# EAGLE design stackclock_base (EAGLE 6.6.0)

## Sheet 1 of 2: Logic & I/O
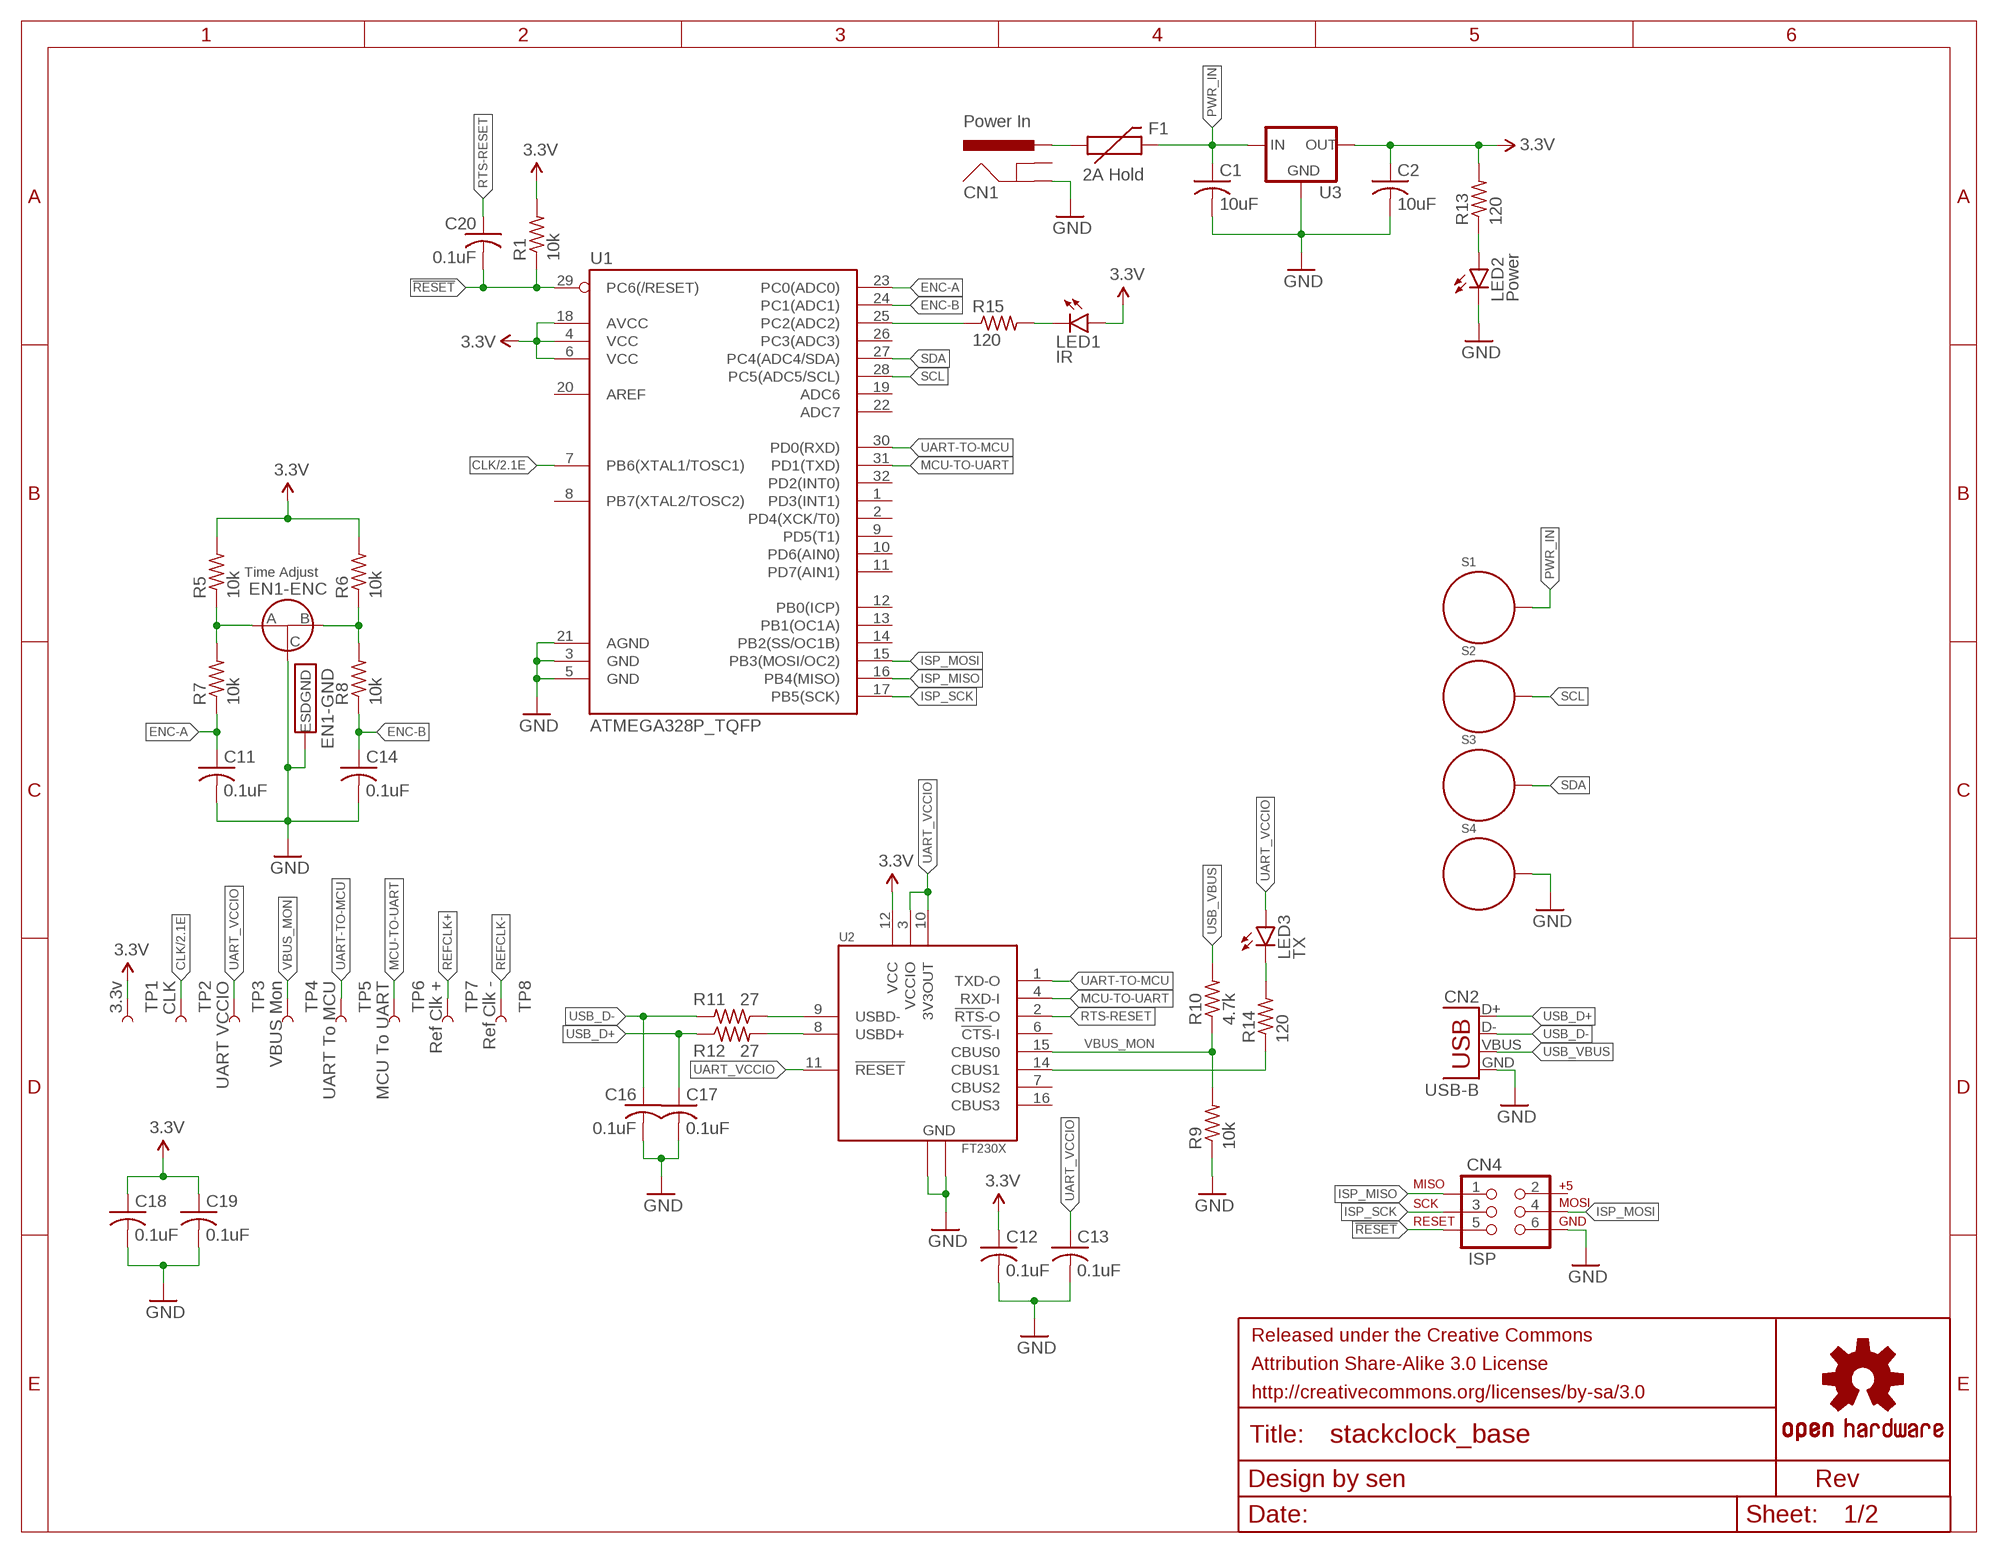
[diagram p0: schematic, sheet 1]

### Parts
C1  10uF  C-USC0805  [C0805]
C2  10uF  C-USC0805  [C0805]
C11  0.1uF  C-USC0603  [C0603]
C12  0.1uF  C-USC0603  [C0603]
C13  0.1uF  C-USC0603  [C0603]
C14  0.1uF  C-USC0603  [C0603]
C16  0.1uF  C-USC0603  [C0603]
C17  0.1uF  C-USC0603  [C0603]
C18  0.1uF  C-USC0603  [C0603]
C19  0.1uF  C-USC0603  [C0603]
C20  0.1uF  C-USC0603  [C0603]
CN1  Power In  POWER_JACKPTH  [POWER_JACK_PTH]
CN2  USB-B  USBPTH  [USB-B-PTH]
CN4  ISP  AVR_SPI_PRG_62X3_LOCK  [2X3_LOCK]
EN1  Time Adjust  BOURNS-PEC12R-2XXXF-N  [BOURNS-PEC12R-2XXXF-N]
F1  2A Hold  PTCSMD  [PTC-1206]
FRAME1  FRAME-LETTER-GRID-OSHW-SENOSHW-LOGO-L  [OSHW-LOGO-L]
LED1  IR  LED1206  [LED-1206]
LED2  Power  LED0603  [LED-0603]
LED3  TX  LED0603  [LED-0603]
R1  10k  R-US_R0603  [R0603]
R5  10k  R-US_R0603  [R0603]
R6  10k  R-US_R0603  [R0603]
R7  10k  R-US_R0603  [R0603]
R8  10k  R-US_R0603  [R0603]
R9  10k  R-US_R0603  [R0603]
R10  4.7k  R-US_R0603  [R0603]
R11  27  R-US_R0603  [R0603]
R12  27  R-US_R0603  [R0603]
R13  120  R-US_R0603  [R0603]
R14  120  R-US_R0603  [R0603]
R15  120  R-US_R0603  [R0603]
S1  VIN  STANDOFF_ELECTRICAL  [STANDOFF-ELECTRICAL]
S2  SCL  STANDOFF_ELECTRICAL  [STANDOFF-ELECTRICAL]
S3  SDA  STANDOFF_ELECTRICAL  [STANDOFF-ELECTRICAL]
S4  GND  STANDOFF_ELECTRICAL  [STANDOFF-ELECTRICAL]
TP1  3.3v  TEST-POINTTP_15TH_THRU  [TP_15TH]
TP2  CLK  TEST-POINTTP_15TH_THRU  [TP_15TH]
TP3  UART VCCIO  TEST-POINTTP_15TH_THRU  [TP_15TH]
TP4  VBUS Mon  TEST-POINTTP_15TH_THRU  [TP_15TH]
TP5  UART To MCU  TEST-POINTTP_15TH_THRU  [TP_15TH]
TP6  MCU To UART  TEST-POINTTP_15TH_THRU  [TP_15TH]
TP7  Ref Clk +  TEST-POINTTP_15TH_THRU  [TP_15TH]
TP8  Ref Clk -  TEST-POINTTP_15TH_THRU  [TP_15TH]
U1  ATMEGA328P_TQFP  [TQFP32-08]
U2  FT230X  [SSOP16]
U3  NCP1117DT33G  V_REG_MC33269DT  [DPAK]

### Nets
3.3V: C2.1 C12.1 C18.1 C19.1 LED1.A R1.2 R5.2 R6.2 R13.2 TP1.P$1 U1.4(VCC) U1.6(VCC) U1.18(AVCC) U2.12(VCC) U3.4(OUT) ; also sheet 2
!RESET: C20.2 CN4.5 R1.1 U1.29(PC6(/RESET))
CLK: TP2.P$1 U1.7(PB6(XTAL1/TOSC1)) ; also sheet 2
DATA_LED: R14.1 U2.14(CBUS1)
ENC-A: C11.1 R7.1 U1.23(PC0(ADC0))
ENC-A_RAW: EN1.A(-ENC:A) R5.1 R7.2
ENC-B: C14.1 R8.1 U1.24(PC1(ADC1))
ENC-B_RAW: EN1.B(-ENC:B) R6.1 R8.2
GND: C1.2 C2.2 C11.2 C12.2 C13.2 C14.2 C16.2 C17.2 C18.2 C19.2 CN1.GND CN2.GND CN4.6 EN1.C(-ENC:C) EN1.SUPPORT1(-GND:ESDGND) EN1.SUPPORT2(-GND:ESDGND) LED2.C R9.1 S4.P1 U1.3(GND) U1.5(GND) U1.21(AGND) U2.5(GND) U2.13(GND) U3.1(GND) ; also sheet 2
IR_CTL: R15.1 U1.25(PC2(ADC2))
IR_R: LED1.C R15.2
ISP_MISO: CN4.1 U1.16(PB4(MISO))
ISP_MOSI: CN4.4 U1.15(PB3(MOSI/OC2))
ISP_SCK: CN4.3 U1.17(PB5(SCK))
LED2_R: LED2.A R13.1
LED3_R: LED3.C R14.2
MCU-TO-UART: TP6.P$1 U1.31(PD1(TXD)) U2.4(RXD-I)
PWR_IN: C1.1 F1.2 S1.P1 U3.3(IN)
PWR_IN_PREFUSE: CN1.PWR F1.1
REFCLK+: TP7.P$1 ; also sheet 2
REFCLK-: TP8.P$1 ; also sheet 2
RTS-RESET: C20.1 U2.2(!RTS!-O)
SCL: S2.P1 U1.28(PC5(ADC5/SCL))
SDA: S3.P1 U1.27(PC4(ADC4/SDA))
UART-TO-MCU: TP5.P$1 U1.30(PD0(RXD)) U2.1(TXD-O)
UART_VCCIO: C13.1 LED3.A TP3.P$1 U2.3(VCCIO) U2.10(3V3OUT) U2.11(!RESET)
USB_D+: C17.1 CN2.D+ R12.1
USB_D+_POSTRES: R12.2 U2.8(USBD+)
USB_D-: C16.1 CN2.D- R11.2
USB_D-_POSTRES: R11.1 U2.9(USBD-)
USB_VBUS: CN2.VBUS R10.2
VBUS_MON: R9.2 R10.1 TP4.P$1 U2.15(CBUS0)
Unconnected: CN1.GNDBREAK CN4.2 U1.1(PD3(INT1)) U1.2(PD4(XCK/T0)) U1.8(PB7(XTAL2/TOSC2)) U1.9(PD5(T1)) U1.10(PD6(AIN0)) U1.11(PD7(AIN1)) U1.12(PB0(ICP)) U1.13(PB1(OC1A)) U1.14(PB2(SS/OC1B)) U1.19(ADC6) U1.20(AREF) U1.22(ADC7) U1.26(PC3(ADC3)) U1.32(PD2(INT0)) U2.6(!CTS!-I) U2.7(CBUS2) U2.16(CBUS3)

## Sheet 2 of 2: Oscillators
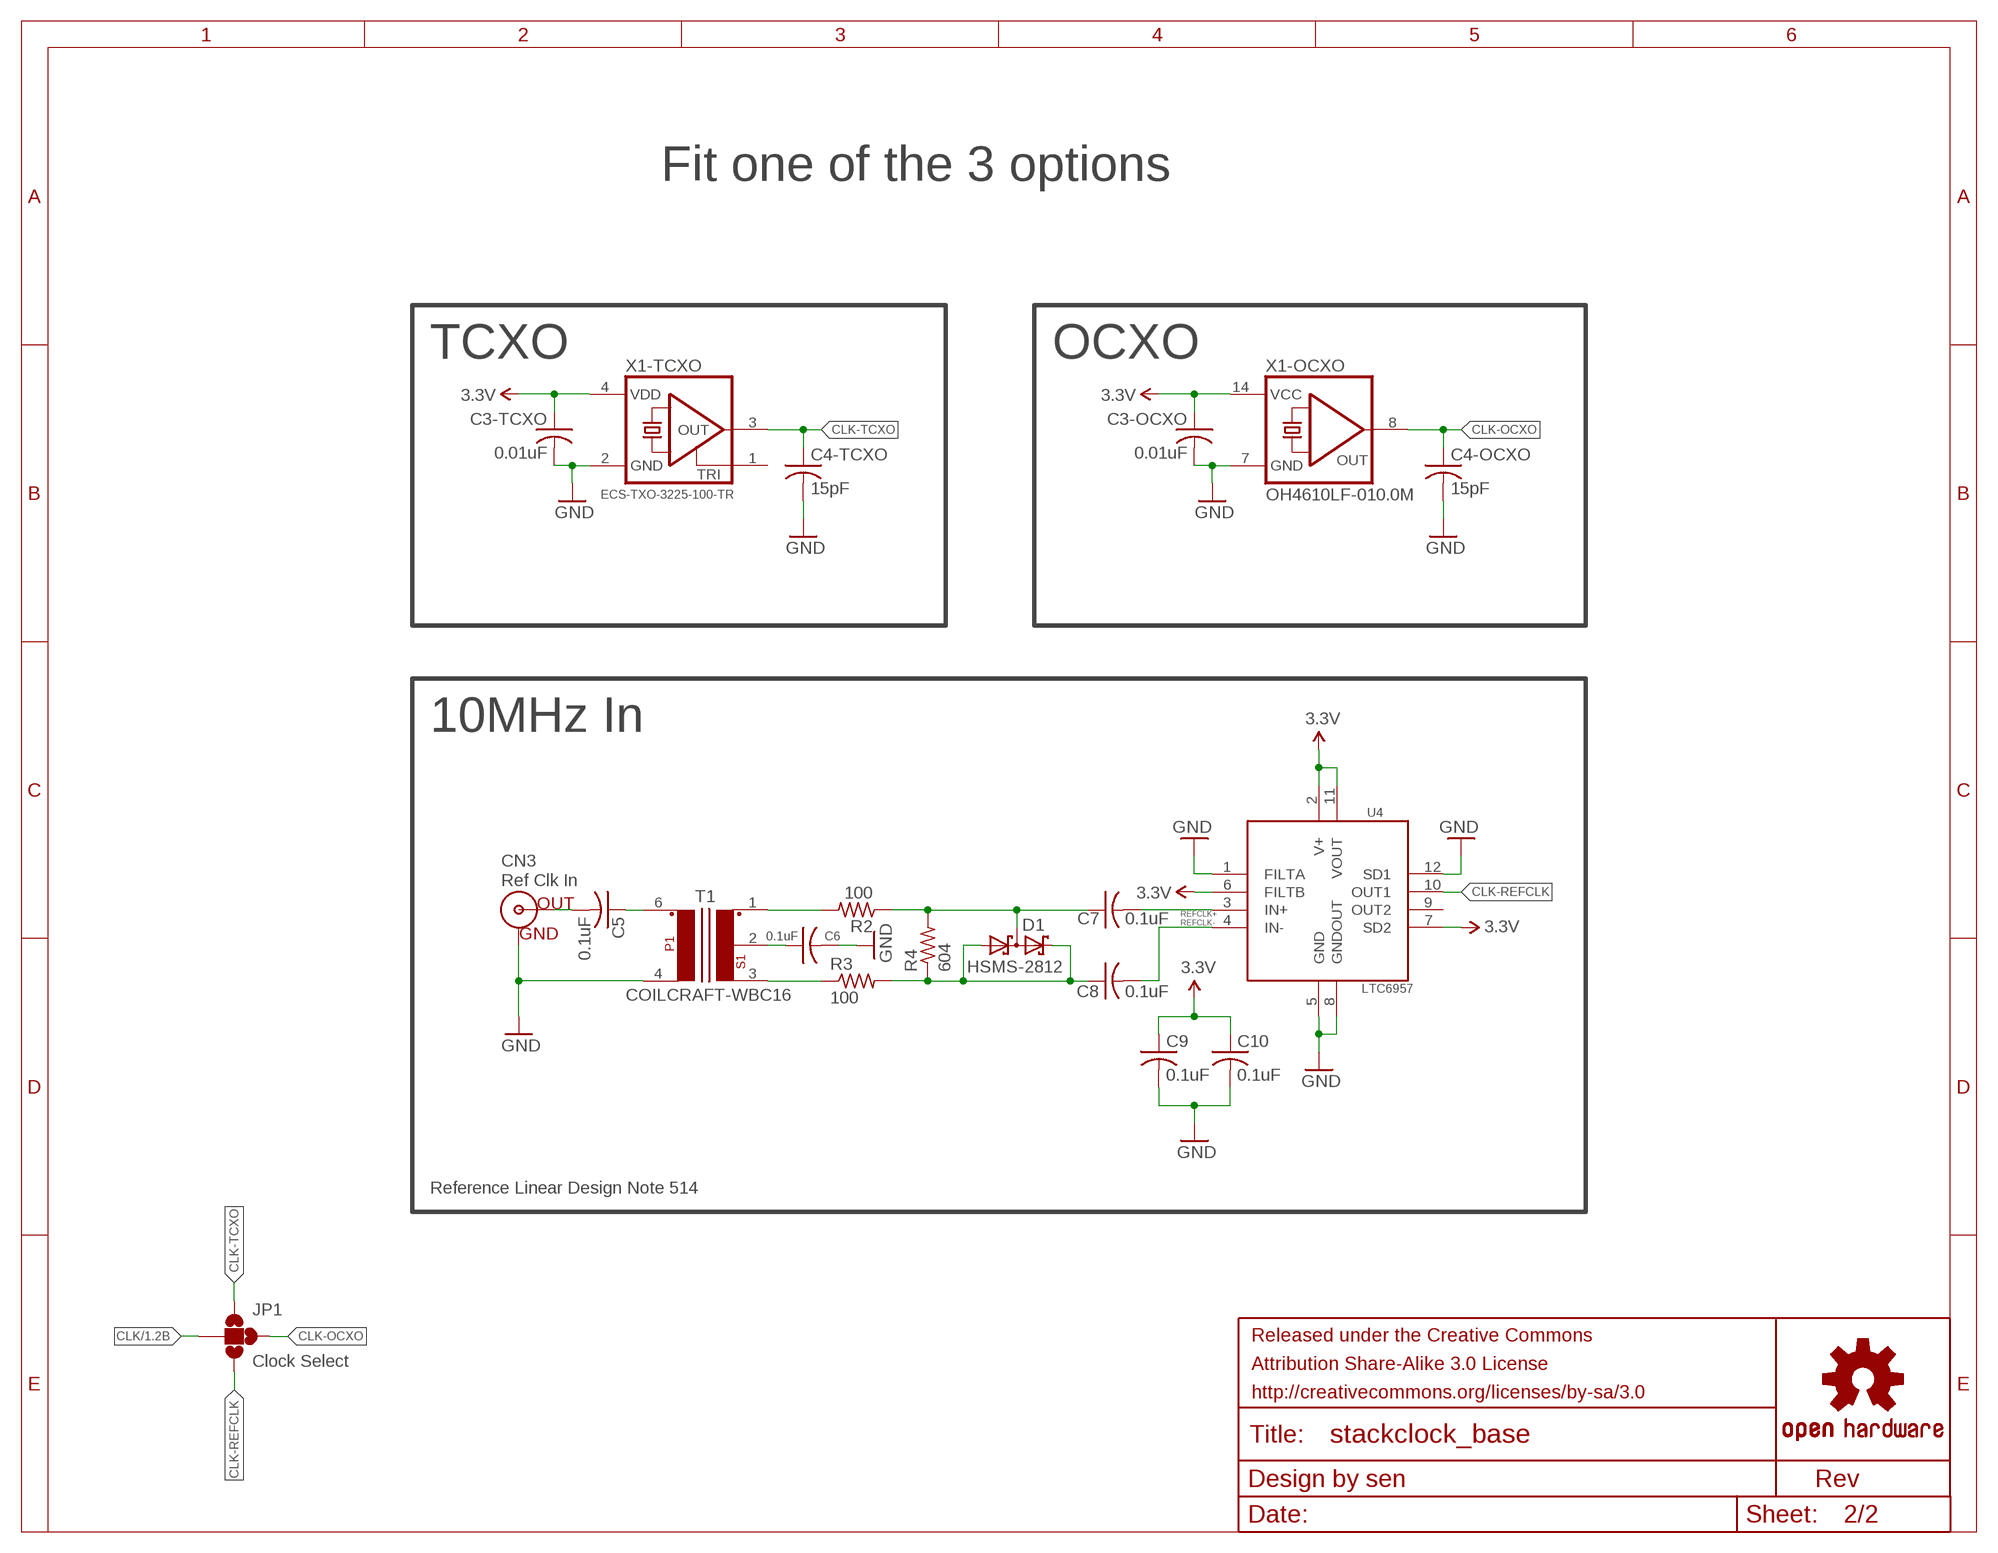
[diagram p1: schematic, sheet 2]

### Parts
C3-OCXO  0.01uF  C-USC0603  [C0603]
C3-TCXO  0.01uF  C-USC0603  [C0603]
C4-OCXO  15pF  C-USC0603  [C0603]
C4-TCXO  15pF  C-USC0603  [C0603]
C5  0.1uF  C-USC0603  [C0603]
C6  0.1uF  C-USC0603  [C0603]
C7  0.1uF  C-USC0603  [C0603]
C8  0.1uF  C-USC0603  [C0603]
C9  0.1uF  C-USC0603  [C0603]
C10  0.1uF  C-USC0603  [C0603]
CN3  Ref Clk In  BNCPTH  [BNC]
D1  HSMS-2812  BAT54S  [SOT23]
FRAME2  FRAME-LETTER-GRID-OSHW-SENOSHW-LOGO-L  [OSHW-LOGO-L]
JP1  Clock Select  JUMPER-PAD-4-NOYES_SILK  [PAD-JUMPER-4-NO_YES_SILK]
R2  100  R-US_R0603  [R0603]
R3  100  R-US_R0603  [R0603]
R4  604  R-US_R0603  [R0603]
T1  COILCRAFT-WBC16  COILCRAFT-WBC16-1TL  [COILCRAFT-WBC]
U4  LTC6957  [MSOP12]
X1-OCXO  OH4610LF-010.0M  QG5860  [DIL14S]
X1-TCXO  ECS-TXO-3225-100-TR  ASE  [ASE]

### Nets
3.3V: C3-OCXO.1 C3-TCXO.1 C9.1 C10.1 U4.2(V+) U4.6(FILTB) U4.7(SD2) U4.11(VOUT) X1-OCXO.14(VCC) X1-TCXO.4(VDD) ; also sheet 1
CLK: JP1.C ; also sheet 1
CLK-OCXO: C4-OCXO.1 JP1.3 X1-OCXO.8(OUT)
CLK-REFCLK: JP1.2 U4.10(OUT1)
CLK-TCXO: C4-TCXO.1 JP1.1 X1-TCXO.3(OUT)
GND: C3-OCXO.2 C3-TCXO.2 C4-OCXO.2 C4-TCXO.2 C6.2 C9.2 C10.2 CN3.GND T1.4(PRI-2) U4.1(FILTA) U4.5(GND) U4.8(GNDOUT) U4.12(SD1) X1-OCXO.7(GND) X1-TCXO.2(GND) ; also sheet 1
REFCLK+: C7.2 U4.3(IN+) ; also sheet 1
REFCLK+-POSTTRANS: R2.2 T1.1(SEC-1)
REFCLK+-PRECAP: C7.1 D1.3(C1A2) R2.1 R4.2
REFCLK-: C8.2 U4.4(IN-) ; also sheet 1
REFCLK--POSTTRANS: R3.1 T1.3(SEC-2)
REFCLK--PRECAP: C8.1 D1.1(A1) D1.2(C2) R3.2 R4.1
REFCLK-CTRTAP: C6.1 T1.2(SEC-CT)
REFCLK_IN: C5.2 CN3.S(OUT)
REFCLK_PRETRANS: C5.1 T1.6(PRI-1)
Unconnected: U4.9(OUT2) X1-TCXO.1(TRI)

### Notes on the sheet
- Fit one of the 3 options
- TCXO | OCXO
- 10MHz In
- Reference Linear Design Note 514

## Library data of the parts
C1 C2 C3-OCXO C3-TCXO C4-OCXO C4-TCXO C5-C14 C16-C20 = rcl:C-US: CAPACITOR, American symbol
CN1 = SparkFun-Connectors:POWER_JACK: Power Jack This is the standard 5.5mm barrel jack for power. The PTH is the most common, proven, reliable, footprint. The Slot footprint only works if the mill layer is transmitted to the PCB fab house so be warned. Mating wall wart : TOL-00298 (and others); PROD_ID: CONN-08197
CN2 = SparkFun-Connectors:USB: USB Connectors USB-B-PTH is fully proven SKU : PRT-00139/CONN-08278 USB-miniB is fully proven SKU : PRT-00587 USB-A-PCB is untested. USB-A-H is throughly reviewed, but untested. Spark Fun Electronics SKU : PRT-00437 USB-B-SMT is throughly reviewed, but untested. Needs silkscreen touching up. USB-A-S has not been used/tested USB-MB-H has not been used/tested USB-MICROB has been used. CONN-09505; PROD_ID: CONN-08278
CN3 = SparkFun-Connectors:BNC: BNC Connector, Mouser Part# 5227161
CN4 = SparkFun-Connectors:AVR_SPI_PRG_6: AVR ISP 6 Pin This is the reduced ISP connector for AVR programming. Common on Arduino. This footprint will take up less PCB space and can be used with a 10-pin to 6-pin adapter such as SKU: BOB-08508 **Special note about "TEST_POINT" package. The stop mask is on the top side, so if you want your programming test points to be on the bottom of your board, make sure to place this package on the bottom side of the board. This also ensure that the orientation to program from the bottom side will be correct.
D1 = diode:BAT54S: Schottky Diodes Pin connection corrected 2011-05-04 Source: Fairchild .. BAT54.pdf
EN1 = switch-sen:BOURNS-PEC12R-2XXXF-N: Right angle encoder w/o switch
F1 = SparkFun-PowerIC:PTC: Resettable Fuse PTC Resettable Fuse. Spark Fun Electronics SKU : COM-08357; PROD_ID: RES-11150
FRAME1 FRAME2 = logos-sen:FRAME-LETTER-GRID-OSHW-SEN: Landscape letter-sized schematic frame w/ OSHW logo, edge grid; REV: 001
JP1 = con-sen:JUMPER-PAD-4-NO: 4-way SMD jumper
LED1-LED3 = SparkFun-LED:LED: LEDs Standard schematic elements and footprints for 5mm, 3mm, 1206, and 0603 sized LEDs. 5mm - Spark Fun Electronics SKU : COM-00529 (and others)
R1-R15 = rcl:R-US_: RESISTOR, American symbol
S1-S4 = SparkFun-Electromechanical:STANDOFF_ELECTRICAL: A standoff intended to be an electrically connected point. Pad size and stop size allow for a #4 Phillips pan screw head to make a solid connection to the board.
T1 = trafo-sen:COILCRAFT-WBC16-1TL: Coilcraft WBC 1:16 signal/audio transformer, CT secondary
TP1-TP8 = SparkFun-Passives:TEST-POINT: Bare copper test points for troubleshooting or ICT
U1 = SparkFun-DigitalIC:ATMEGA328P_TQFP; PROD_ID: IC-09069
U2 = ftdi-sen:FT230X: FT230X basic 4-wire USB to RS232 converter.
U3 = SparkFun-PowerIC:V_REG_MC33269
U4 = linear-sen:LTC6957: LTC6957 clock buffer/driver/converter
X1-OCXO = crystal:QG5860: CRYSTAL RESONATOR; OC_FARNELL: unknown; OC_NEWARK: unknown
X1-TCXO = crystal:ASE: 3.3Vdc CMOS SMD CRYSTAL CLOCK OSCILLATOR SOurce: www.abracon.com; OC_FARNELL: unknown; OC_NEWARK: unknown

## Board
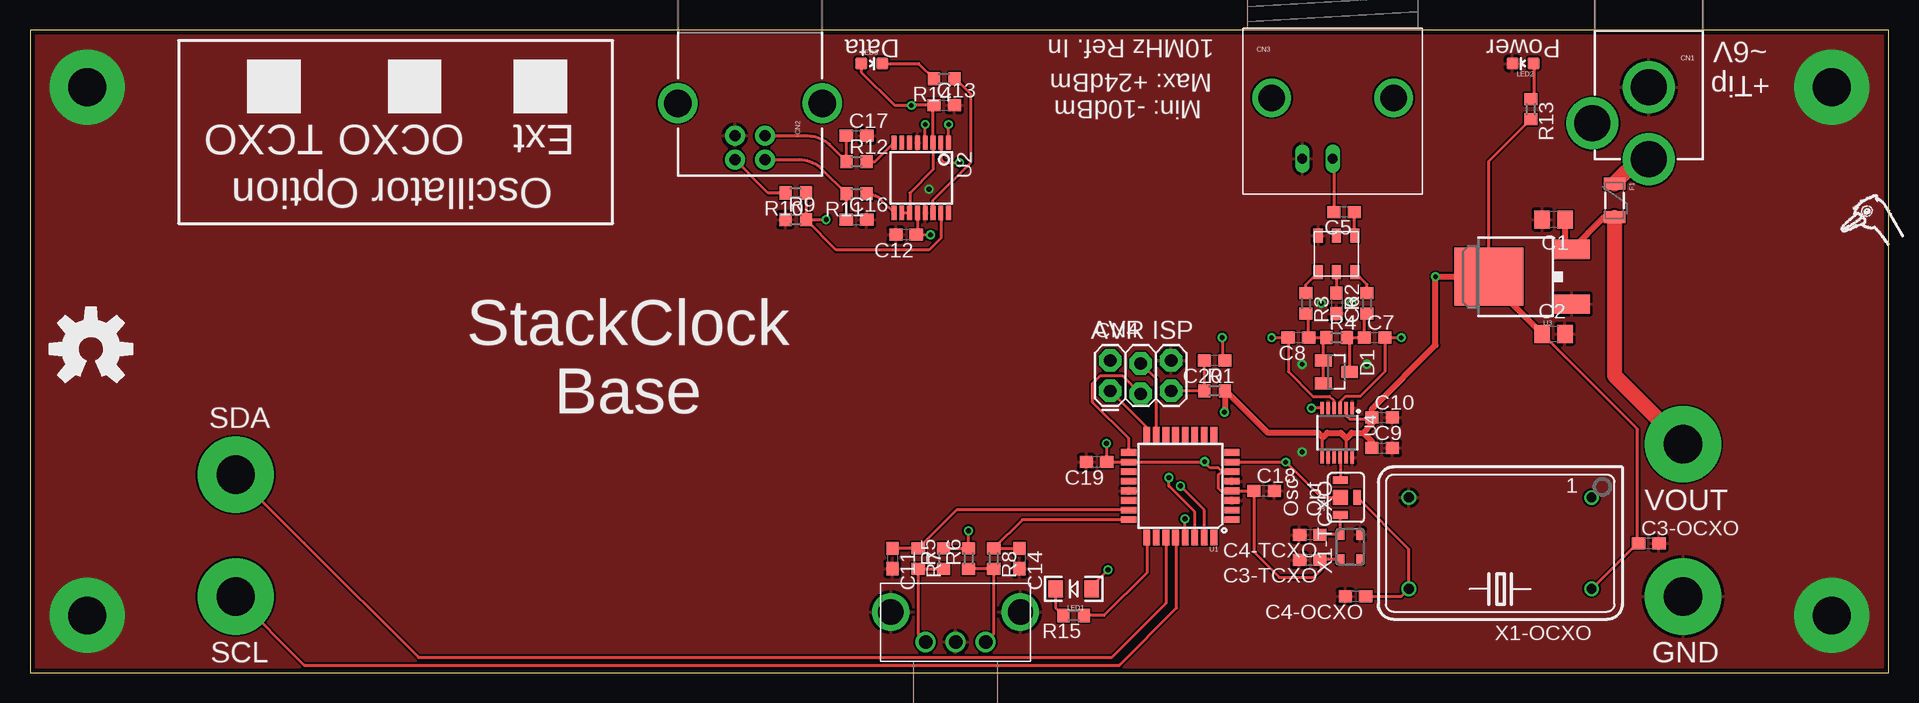
[diagram p2: board, top side]
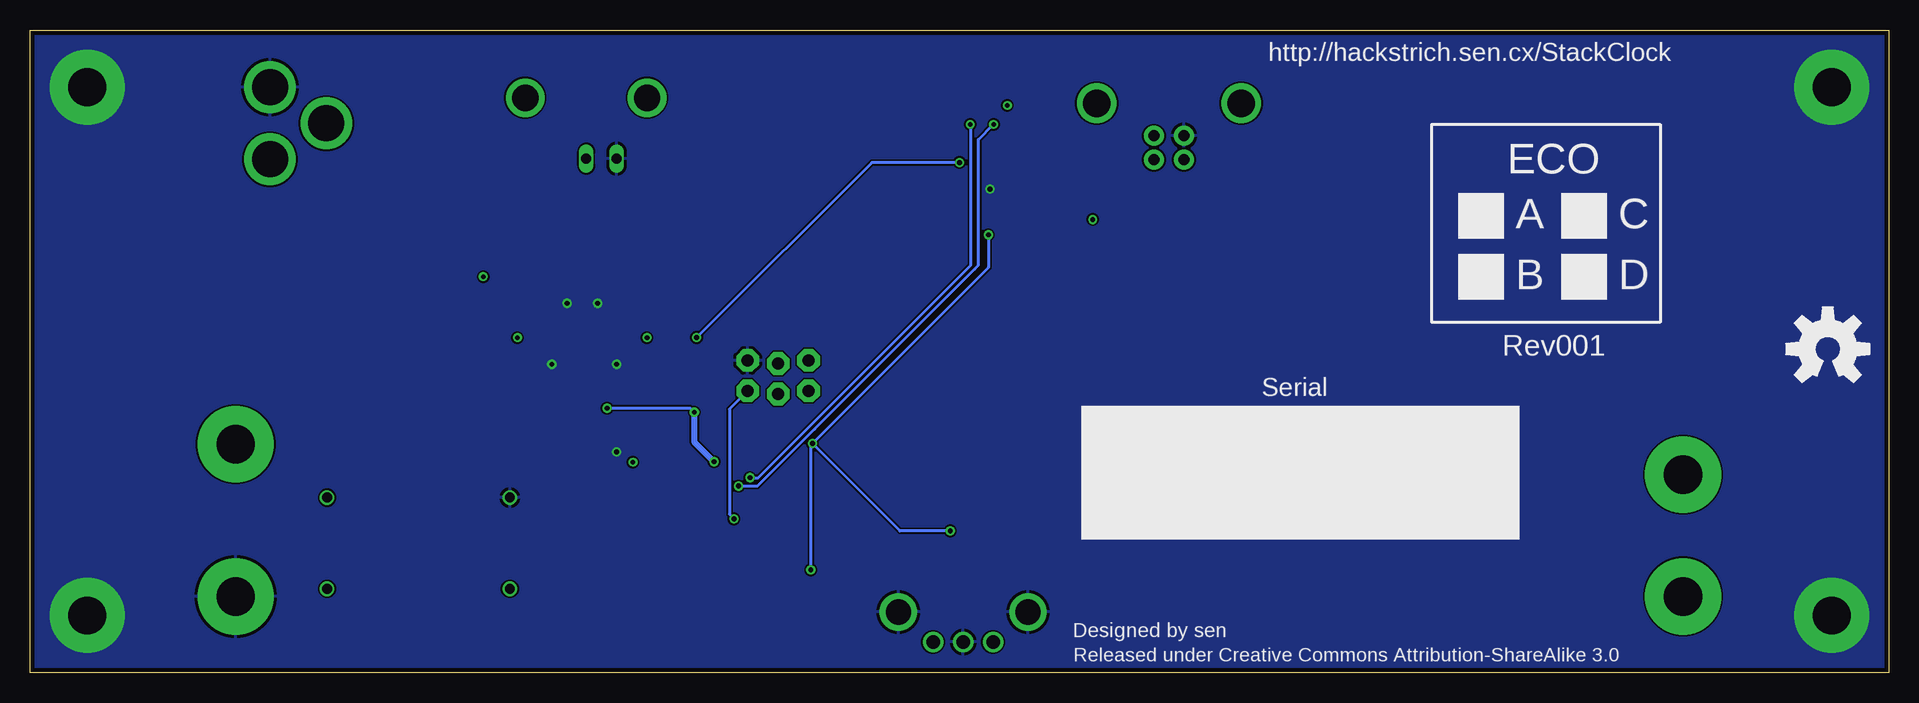
[diagram p3: board, bottom side, seen from below]

Size 154.94 x 53.59 mm. Coordinates in mm from the lower left corner, seen from the top.
Outline: 0,0 154.94,0 154.94,53.59 0,53.59 0,0
Copper layers (1*16): Top 0.0356mm / dielectric 1.5011mm / Bottom 0.0356mm
Design rules "LaenPCBOrder-sen *": minimum track width 6mil, minimum drill 13mil, track to track 6mil, track to pad 6mil, pad to pad 6mil, via to via 6mil, smd to smd 6mil, copper to edge 15mil, drill to drill 6mil, minimum pad ring 7mil, minimum via ring 7mil, stop-mask expansion 4mil, vias tented up to drill 25mil, thermal gap 10mil

### Footprints (pad centres in the part's own frame; a part is rotated, then mirrored left to right if it is on the bottom)
C0805 = smd 1.3 x 1.5: 1 -0.95,0; 2 0.95,0
C0603 = smd 1.1 x 1: 1 -0.85,0; 2 0.85,0
POWER_JACK_PTH = drill 2.997 pad 4.318: GND 0,7.7; GNDBREAK 4.7,10.7; PWR 0,13.7
USB-B-PTH = drill 0.914 pad 1.676: D+ 0,1.25; D- 1.981,1.25; GND 0,-1.25; VBUS 1.981,-1.25 | drill 2.286: S1 -2.718,-6.02; S2 -2.718,6.02
BNC = drill 2.2: 3 -5.08,5.08; 4 5.08,5.08 | drill 0.8 long: GND -2.54,0; S 0,0
2X3_LOCK = drill 1.016 pad 1.88 octagon: 1 0,0; 2 0,2.54; 3 2.54,-0.254; 4 2.54,2.286; 5 5.08,0; 6 5.08,2.54
SOT23 = smd 1 x 1.4: 1 -0.95,-1.1; 2 0.95,-1.1; 3 0,1.1
BOURNS-PEC12R-2XXXF-N = drill 1.125: A -2.5,1.6; B 2.5,1.6; C 0,1.6 | drill 2.1: SUPPORT1 -5.4,4.1; SUPPORT2 5.4,4.1
PTC-1206 = smd 1 x 1.8: 1 -1.4,0; 2 1.4,0
PAD-JUMPER-4-NO_YES_SILK = smd 0.635 x 1.27: 1 -1.448,0; 2 1.448,0 | smd 1.27 x 0.635: 3 0,-1.41 | smd 1.27 x 1.27: C 0,0
LED-1206 = smd 1.2 x 1.4: A -1.5,0; C 1.5,0
LED-0603 = smd 1 x 1: A 0,-0.877; C 0,0.877
R0603 = smd 1 x 1.1: 1 -0.85,0; 2 0.85,0
STANDOFF-ELECTRICAL = drill 3.2 pad 6.35: P1 0,0
COILCRAFT-WBC = smd 0.762 x 1.143: 1 -1.524,1.524; 2 0,1.524; 3 1.524,1.524; 4 1.524,-1.524; 5 0,-1.524; 6 -1.524,-1.524
TP_15TH = drill 0.381 pad 0.61: P$1 0,0
TQFP32-08 = smd 1.27 x 0.559: 1 -4.293,2.8; 2 -4.293,2; 3 -4.293,1.2; 4 -4.293,0.4; 5 -4.293,-0.4; 6 -4.293,-1.2; 7 -4.293,-2; 8 -4.293,-2.8; 17 4.293,-2.8; 18 4.293,-2; 19 4.293,-1.2; 20 4.293,-0.4; 21 4.293,0.4; 22 4.293,1.2; 23 4.293,2; 24 4.293,2.8 | smd 0.559 x 1.27: 9 -2.8,-4.293; 10 -2,-4.293; 11 -1.2,-4.293; 12 -0.4,-4.293; 13 0.4,-4.293; 14 1.2,-4.293; 15 2,-4.293; 16 2.8,-4.293; 25 2.8,4.293; 26 2,4.293; 27 1.2,4.293; 28 0.4,4.293; 29 -0.4,4.293; 30 -1.2,4.293; 31 -2,4.293; 32 -2.8,4.293
SSOP16 = smd 0.4 x 1.2: 1 -2.275,-2.925; 2 -1.625,-2.925; 3 -0.975,-2.925; 4 -0.325,-2.925; 5 0.325,-2.925; 6 0.975,-2.925; 7 1.625,-2.925; 8 2.275,-2.925; 9 2.275,2.925; 10 1.625,2.925; 11 0.975,2.925; 12 0.325,2.925; 13 -0.325,2.925; 14 -0.975,2.925; 15 -1.625,2.925; 16 -2.275,2.925
DPAK = smd 1.6 x 3: 1 -2.28,-5.31; 3 2.28,-5.31 | smd 4.826 x 5.715: 4 0,1.588
MSOP12 = smd 0.3 x 1: 1 -1,-2.05; 2 -0.5,-2.05; 3 0,-2.05; 4 0.5,-2.05; 5 1,-2.05; 6 1.5,-2.05; 7 1.5,2.05; 8 1,2.05; 9 0.5,2.05; 10 0,2.05; 11 -0.5,2.05; 12 -1,2.05
DIL14S = drill 0.813: 1 -7.62,-3.81; 7 7.62,-3.81; 8 7.62,3.81; 14 -7.62,3.81
ASE = smd 0.9 x 0.65: 1 -1.05,-0.825; 2 1.05,-0.825; 3 1.05,0.825; 4 -1.05,0.825

### Placement (x,y rotation side)
C1  127,37.78 180 top
C2  127,28.26 0 top
C3-OCXO  134.94,10.79 0 top
C3-TCXO  106.68,9.4 180 top
C4-OCXO  110.49,6.35 180 top
C4-TCXO  106.68,11.49 180 top
C5  109.54,38.42 180 top
C6  108.9,30.8 270 top
C7  112.08,27.94 0 top
C8  105.73,27.94 180 top
C9  112.71,18.73 0 top
C10  112.71,21.27 0 top
C11  71.88,9.53 270 top
C12  73.03,36.51 180 top
C13  76.2,47.31 0 top
C14  82.49,9.53 270 top
C16  68.9,37.78 0 top
C17  68.9,44.77 0 top
C18  102.87,15.17 0 top
C19  88.9,17.56 180 top
C20  98.74,26.04 180 top
CN1  134.94,56.52 180 top
CN2  60.01,44.77 270 top
CN3  108.58,42.86 0 top
CN4  90.04,23.5 0 top
D1  108.9,25.08 270 top
EN1  77.15,0.95 0 top
F1  132.08,39.37 270 top
FRAME1  5.08,26.99 0 top
FRAME2  5.08,26.99 0 bottom
JP1  109.22,14.61 90 top
LED1  87,6.99 180 top
LED2  124.46,50.8 90 top
LED3  70.17,50.8 270 top
R1  98.74,23.5 0 top
R2  111.44,30.8 90 top
R3  106.36,30.8 270 top
R4  108.9,27.94 0 top
R5  76.14,9.53 90 top
R6  78.23,9.53 90 top
R7  74.04,9.53 270 top
R8  80.33,9.53 270 top
R9  63.82,37.78 0 top
R10  63.82,40.01 180 top
R11  68.9,39.94 180 top
R12  68.9,42.61 0 top
R13  125.09,46.99 270 top
R14  76.2,49.53 180 top
R15  87,4.76 180 top
S1  137.79,19.05 0 top
S2  17.14,6.35 0 top
S3  17.14,16.51 0 top
S4  137.79,6.35 0 top
T1  108.9,34.92 180 top
TP1  117.16,33.02 0 bottom
TP2  104.68,17.56 0 bottom
TP3  73.47,47.31 0 bottom
TP4  66.36,37.78 0 bottom
TP5  76.57,45.72 0 bottom
TP6  74.62,45.72 0 bottom
TP7  114.3,27.94 0 bottom
TP8  103.5,27.94 0 bottom
U1  95.89,15.56 180 top
U2  74.3,41.27 180 top
U3  123.19,33.02 90 top
U4  109.22,20 180 top
U$1  [STRICH-LOGO]  153.99,37.47 30 top
X1-OCXO  122.56,10.79 180 top
X1-TCXO  110.05,10.48 90 top

### Tracks (layer width: path | path; a pad name or v marks a point on that pad's centre or on a via)
3.3V  (via drill 0.41)
  Top 0.254: U4.2 109.73,21.4 109.98,21.14 111.74,21.14 C10.1 | 111.73,18.87 C9.1 | R5.2 R6.2 v78.23,11.81 | X1-TCXO.4 107.56,9.43 C3-TCXO.1 107.63,9.3 107.63,8.57 107,7.94 104.14,7.94 102.02,10.06 C18.1 102.01,15.16 U1.4 99.27,15.16 99.06,15.37 99.06,16.51 99.31,16.76 99.38,16.76 | C3-OCXO.1 133.99,10.79 | 133.99,10.79 X1-OCXO.14 | U3.4 121.6,42.65 R13.2 | 133.99,10.79 133.99,20.32 C2.1 | U1.6 99.38,16.76 | 88.58,6.99 LED1.A 88.5,7.21 v89.85,8.57 | 99.38,16.76 99.06,17.07 98.37,17.07 97.89,17.56 97.79,17.56 U1.18 C19.1 89.72,17.58 v89.72,19.11 | v75.06,36.51 C12.1 73.97,36.61 U2.12 | U4.11 109.72,19.55 | U4.7 107.72,19.58 107.76,19.62 | R1.2 99.69,23.5 | U4.6 v106.83,22.05
  Top 0.508: C2.1 121.6,32.71 U3.4 TP1.P$1 117.16,27.3 111.86,22.01 C10.1 111.86,20.74 111.12,20 | C9.1 111.86,19.27 111.12,20 | 111.12,20 110.17,20 109.72,19.55 109.27,20 108.14,20 107.76,19.62 107.38,20 103.19,20 99.69,23.5 | R1.2 99.59,21.74 v99.57,21.72 | v97.92,17.59 97.82,17.59 97.79,17.56
  Bottom 0.254: v75.06,36.51 75.06,33.78 v89.72,19.11 | v89.85,8.57 89.85,18.99 v89.72,19.11 | v78.23,11.81 82.42,11.81 v89.72,19.11 | v106.83,22.05 99.9,22.05 v99.57,21.72
  Bottom 0.508: v99.57,21.72 99.57,19.24 v97.92,17.59
!RESET  (via drill 0.41)
  Top 0.254: C20.2 R1.1 CN4.5 | U1.29 96.28,12.81 v96.27,12.83
  Bottom 0.254: CN4.5 96.65,21.97 96.65,13.21 v96.27,12.83
CLK
  Top 0.254: U1.7 TP2.P$1 107.63,14.61 JP1.C
CLK-OCXO
  Top 0.254: JP1.3 114.94,10.3 X1-OCXO.8 114.3,6.35 C4-OCXO.1
CLK-REFCLK
  Top 0.254: U4.10 JP1.2
CLK-TCXO
  Top 0.254: C4-TCXO.1 107.56,11.53 X1-TCXO.3 JP1.1
DATA_LED
  Top 0.254: U2.14 75.27,39.39 78.42,42.55 78.42,48.26 77.15,49.53 R14.1
ENC-A
  Top 0.254: C11.1 R7.1 77.22,13.56 U1.23
ENC-A_RAW
  Top 0.254: R5.1 R7.2 74.04,3.16 EN1.A
ENC-B
  Top 0.254: C14.1 R8.1 82.71,12.76 U1.24
ENC-B_RAW
  Top 0.254: R6.1 R8.2 80.33,3.23 EN1.B
GND  (via drill 0.41, 3.15 pad 6.25)
  other vias: 107.63,30.8 110.17,30.8 111.44,25.72 106.05,25.72 106.05,18.41 74.93,40.32 4.76,4.76 150.18,4.76 4.76,48.83 150.18,48.83
  pour Top: 0,53.66 154.94,53.66 154.94,0 0,0
  pour Bottom: 0,53.66 154.94,53.66 154.94,0 0,0
IR_CTL
  Top 0.254: U1.25 93.08,8.31 89.53,4.76 R15.1
IR_R
  Top 0.254: LED1.C 85.5,5.41 R15.2
ISP_MISO
  Top 0.254: U1.16 93.08,20.45 CN4.1
ISP_MOSI
  Top 0.254: U1.15 93.89,24.48 CN4.4
ISP_SCK
  Top 0.254: U1.17 91.59,19.53 88.58,22.54 88.58,24.13 89.22,24.77 91.06,24.77 CN4.3
LED2_R
  Top 0.254: LED2.A 125.34,48.08 R13.1
LED3_R
  Top 0.254: LED3.C 74.08,50.8 R14.2
MCU-TO-UART  (via drill 0.41)
  Top 0.254: U2.4 TP6.P$1 | U1.31 97.89,13.56 v95.89,15.56
  Bottom 0.254: v95.89,15.56 94.3,15.56 89.53,20.32 76.2,33.66 75.88,33.97 75.88,44.46 TP6.P$1
PWR_IN
  Top 0.508: C1.1 127.95,35.85 U3.3 131.17,37.97 F1.2
  Top 1.27: F1.2 132.08,24.77 S1.P1
PWR_IN_PREFUSE
  Top 1.27: CN1.PWR 134.12,42.81 F1.1
REFCLK+
  Top 0.254: U4.3 109.22,22.61 109.67,23.05 110.87,23.05 112.93,25.11 C7.2 TP7.P$1
REFCLK+-POSTTRANS
  Top 0.254: R2.2 111.44,32.38 T1.1
REFCLK+-PRECAP
  Top 0.254: R2.1 111.23,29.73 C7.1 R4.2 110,27.69 D1.3
REFCLK-
  Top 0.254: U4.4 108.72,22.66 108.33,23.05 106.93,23.05 104.88,25.11 C8.2 TP8.P$1
REFCLK--POSTTRANS
  Top 0.254: R3.1 106.36,32.38 T1.3
REFCLK--PRECAP
  Top 0.254: R3.2 106.58,29.73 C8.1 R4.1 107.8,27.69 D1.1 D1.2
REFCLK-CTRTAP
  Top 0.254: T1.2 C6.1
REFCLK_IN
  Top 0.254: CN3.S 108.69,42.86 C5.2
REFCLK_PRETRANS
  Top 0.254: T1.6 110.39,36.45 C5.1
RTS-RESET  (via drill 0.41)
  Top 0.254: v99.38,27.94 99.38,26.25 C20.1 | U2.2 75.92,42.83 76.2,42.55 v77.47,42.55
  Bottom 0.254: v77.47,42.55 84.77,42.55 v99.38,27.94
SCL
  Top 0.254: S2.P1 22.86,0.64 90.81,0.64 95.57,5.4 95.57,11.18 U1.28
SDA
  Top 0.254: S3.P1 22.86,10.79 32.38,1.27 90.17,1.27 94.61,5.71 94.69,5.79 U1.27
UART-TO-MCU  (via drill 0.41)
  Top 0.254: U2.1 TP5.P$1 | U1.30 97.08,13.4 94.93,15.56 v94.93,16.26
  Bottom 0.254: v94.93,16.26 94.23,16.26 85.72,24.77 76.52,33.97 76.52,45.67 TP5.P$1
UART_VCCIO
  Top 0.254: U2.10 U2.11 73.34,38.37 73.34,40.01 75.27,41.93 U2.3 75.27,47.23 C13.1 TP3.P$1 72.07,47.31 69.29,50.09 LED3.A
USB_D+
  Top 0.254: CN2.D+ 63.79,44.77 64.84,44.77 arc-45 66.63,44.02 R12.1 C17.1 67.86,44.77
USB_D+_POSTRES
  Top 0.254: R12.2 70.43,42.61 U2.8 72.02,44.01
USB_D-
  Top 0.254: C16.1 R11.2 65.95,42.04 arc45 64.15,42.79 CN2.D-
USB_D-_POSTRES
  Top 0.254: R11.1 arc-45 70.91,39.46 U2.9
USB_VBUS
  Top 0.254: R10.2 61.54,40.01 CN2.VBUS
VBUS_MON
  Top 0.254: R10.1 R9.2 | R9.2 TP4.P$1 | U2.15 75.92,36.23 74.93,35.24 67.21,35.24 R9.2

### Text on the board
tPlace: Data | 10MHz Ref. In | Power | ~6V | Max: +24dBm | +Tip | Min: -10dBm | TCXO | OCXO | Ext | Oscillator Option | AVR ISP | StackClock / Base | SDA | VOUT | Osc / Opt | SCL | GND
bPlace: http://hackstrich.sen.cx/StackClock | ECO | C | A | D | B | Rev001 | Serial | Designed by sen | Released under Creative Commons Attribution-ShareAlike 3.0